# EAGLE design terminator (EAGLE 6.6.0)
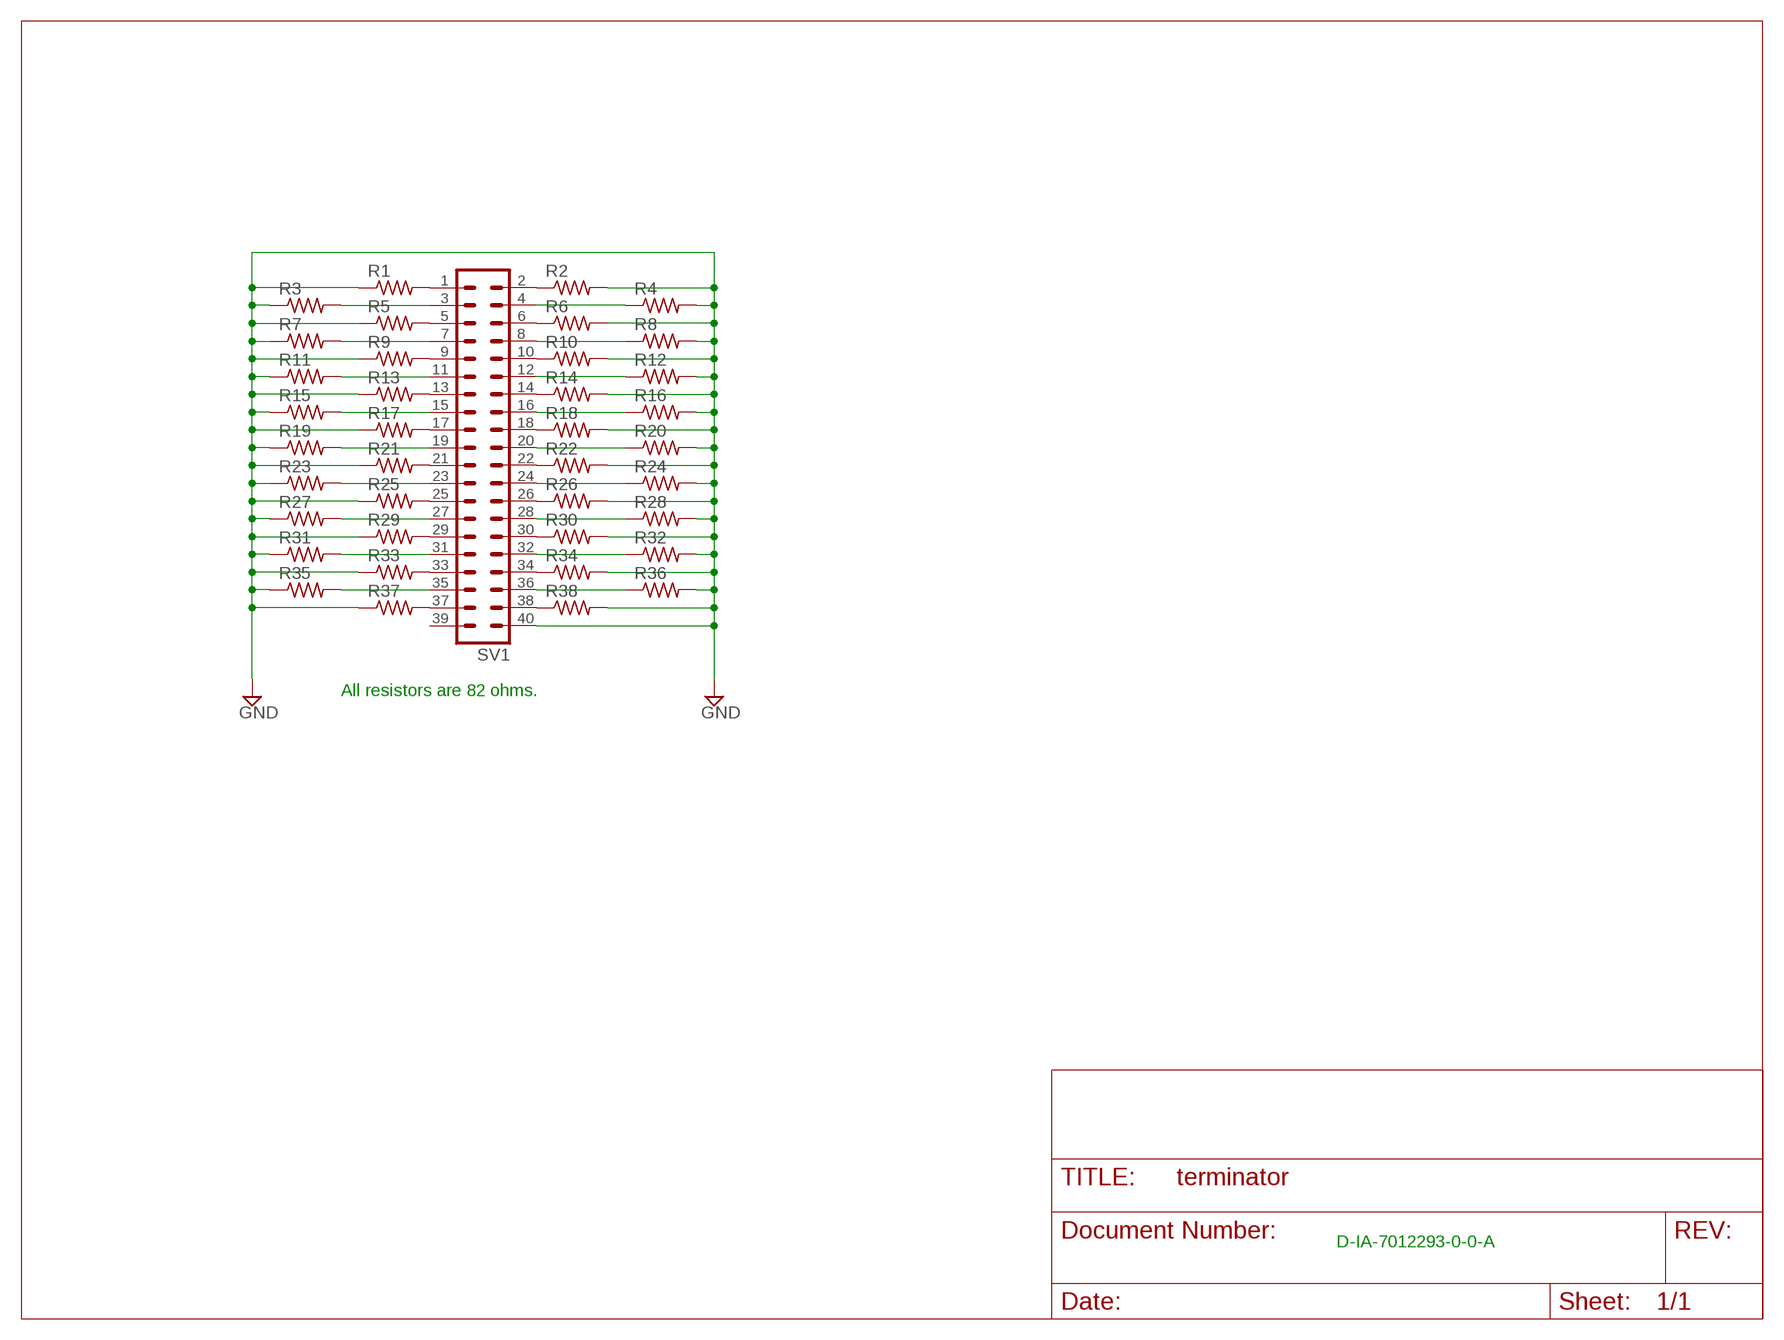
[diagram p0: schematic, sheet 1]

## Parts
R1  R-US_M0805  [M0805]
R2  R-US_M0805  [M0805]
R3  R-US_M0805  [M0805]
R4  R-US_M0805  [M0805]
R5  R-US_M0805  [M0805]
R6  R-US_M0805  [M0805]
R7  R-US_M0805  [M0805]
R8  R-US_M0805  [M0805]
R9  R-US_M0805  [M0805]
R10  R-US_M0805  [M0805]
R11  R-US_M0805  [M0805]
R12  R-US_M0805  [M0805]
R13  R-US_M0805  [M0805]
R14  R-US_M0805  [M0805]
R15  R-US_M0805  [M0805]
R16  R-US_M0805  [M0805]
R17  R-US_M0805  [M0805]
R18  R-US_M0805  [M0805]
R19  R-US_M0805  [M0805]
R20  R-US_M0805  [M0805]
R21  R-US_M0805  [M0805]
R22  R-US_M0805  [M0805]
R23  R-US_M0805  [M0805]
R24  R-US_M0805  [M0805]
R25  R-US_M0805  [M0805]
R26  R-US_M0805  [M0805]
R27  R-US_M0805  [M0805]
R28  R-US_M0805  [M0805]
R29  R-US_M0805  [M0805]
R30  R-US_M0805  [M0805]
R31  R-US_M0805  [M0805]
R32  R-US_M0805  [M0805]
R33  R-US_M0805  [M0805]
R34  R-US_M0805  [M0805]
R35  R-US_M0805  [M0805]
R36  R-US_M0805  [M0805]
R37  R-US_M0805  [M0805]
R38  R-US_M0805  [M0805]
SV1  MA20-2  [MA20-2]

## Nets
GND: R1.1 R2.2 R3.1 R4.2 R5.1 R6.2 R7.1 R8.2 R9.1 R10.2 R11.1 R12.2 R13.1 R14.2 R15.1 R16.2 R17.1 R18.2 R19.1 R20.2 R21.1 R22.2 R23.1 R24.2 R25.1 R26.2 R27.1 R28.2 R29.1 R30.2 R31.1 R32.2 R33.1 R34.2 R35.1 R36.2 R37.1 R38.2 SV1.40
N$1: R1.2 SV1.1
N$2: R2.1 SV1.2
N$3: R5.2 SV1.5
N$4: R6.1 SV1.6
N$5: R9.2 SV1.9
N$6: R10.1 SV1.10
N$7: R13.2 SV1.13
N$8: R14.1 SV1.14
N$9: R17.2 SV1.17
N$10: R18.1 SV1.18
N$11: R21.2 SV1.21
N$12: R22.1 SV1.22
N$13: R25.2 SV1.25
N$14: R26.1 SV1.26
N$15: R29.2 SV1.29
N$16: R30.1 SV1.30
N$17: R33.2 SV1.33
N$18: R34.1 SV1.34
N$19: R37.2 SV1.37
N$20: R38.1 SV1.38
N$21: R3.2 SV1.3
N$22: R7.2 SV1.7
N$23: R11.2 SV1.11
N$24: R15.2 SV1.15
N$25: R19.2 SV1.19
N$26: R23.2 SV1.23
N$27: R27.2 SV1.27
N$28: R31.2 SV1.31
N$29: R35.2 SV1.35
N$30: R36.1 SV1.36
N$31: R32.1 SV1.32
N$32: R28.1 SV1.28
N$33: R24.1 SV1.24
N$34: R20.1 SV1.20
N$35: R16.1 SV1.16
N$36: R12.1 SV1.12
N$37: R8.1 SV1.8
N$38: R4.1 SV1.4
Unconnected: SV1.39

## Notes on the sheet
- All resistors are 82 ohms.
- D-IA-7012293-0-0-A

## Library data of the parts
R1-R38 = rcl:R-US_: RESISTOR, American symbol
SV1 = con-lstb:MA20-2: PIN HEADER; OC_FARNELL: unknown; OC_NEWARK: unknown

## Net classes
0 default: width 0.508 mm

## Board
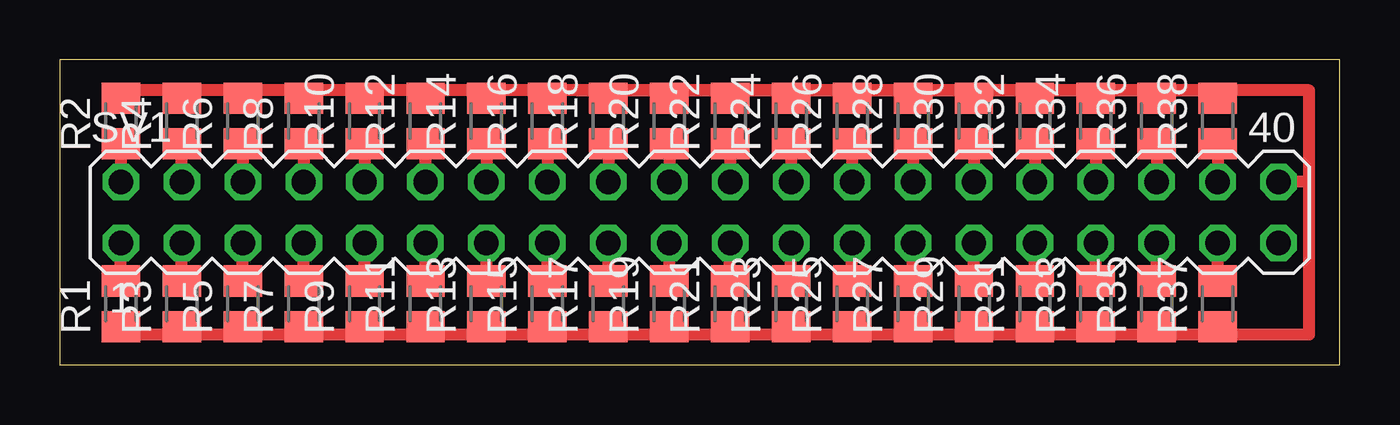
[diagram p1: board, top side]

Size 53.34 x 12.7 mm. Coordinates in mm from the lower left corner, seen from the top.
Outline: 0,0 53.34,0 53.34,12.7 0,12.7 0,0
Copper layers (1+16): Top 0.035mm / dielectric 1.5mm / Bottom 0.035mm
Design rules "16mils *": minimum track width 16mil, minimum drill 32mil, track to track 15mil, track to pad 10mil, pad to pad 10mil, via to via 10mil, smd to smd 0mil, copper to edge 13mil, drill to drill 10mil, minimum pad ring 10mil, minimum via ring 8mil, stop-mask expansion 0mil, vias tented up to drill 0mil, thermal gap 10mil

### Footprints (pad centres in the part's own frame; a part is rotated, then mirrored left to right if it is on the bottom)
M0805 = smd 1.3 x 1.6: 1 -0.95,0; 2 0.95,0
MA20-2 = drill 1.016 octagon: 1 -24.13,-1.27; 2 -24.13,1.27; 3 -21.59,-1.27; 4 -21.59,1.27; 5 -19.05,-1.27; 6 -19.05,1.27; 7 -16.51,-1.27; 8 -16.51,1.27; 9 -13.97,-1.27; 10 -13.97,1.27; 11 -11.43,-1.27; 12 -11.43,1.27; 13 -8.89,-1.27; 14 -8.89,1.27; 15 -6.35,-1.27; 16 -6.35,1.27; 17 -3.81,-1.27; 18 -3.81,1.27; 19 -1.27,-1.27; 20 -1.27,1.27; 21 1.27,-1.27; 22 1.27,1.27; 23 3.81,-1.27; 24 3.81,1.27; 25 6.35,-1.27; 26 6.35,1.27; 27 8.89,-1.27; 28 8.89,1.27; 29 11.43,-1.27; 30 11.43,1.27; 31 13.97,-1.27; 32 13.97,1.27; 33 16.51,-1.27; 34 16.51,1.27; 35 19.05,-1.27; 36 19.05,1.27; 37 21.59,-1.27; 38 21.59,1.27; 39 24.13,-1.27; 40 24.13,1.27

### Placement (x,y rotation side)
R1  2.54,2.54 90 top
R2  2.54,10.16 90 top
R3  5.08,2.54 90 top
R4  5.08,10.16 90 top
R5  7.62,2.54 90 top
R6  7.62,10.16 90 top
R7  10.16,2.54 90 top
R8  10.16,10.16 90 top
R9  12.7,2.54 90 top
R10  12.7,10.16 90 top
R11  15.24,2.54 90 top
R12  15.24,10.16 90 top
R13  17.78,2.54 90 top
R14  17.78,10.16 90 top
R15  20.32,2.54 90 top
R16  20.32,10.16 90 top
R17  22.86,2.54 90 top
R18  22.86,10.16 90 top
R19  25.4,2.54 90 top
R20  25.4,10.16 90 top
R21  27.94,2.54 90 top
R22  27.94,10.16 90 top
R23  30.48,2.54 90 top
R24  30.48,10.16 90 top
R25  33.02,2.54 90 top
R26  33.02,10.16 90 top
R27  35.56,2.54 90 top
R28  35.56,10.16 90 top
R29  38.1,2.54 90 top
R30  38.1,10.16 90 top
R31  40.64,2.54 90 top
R32  40.64,10.16 90 top
R33  43.18,2.54 90 top
R34  43.18,10.16 90 top
R35  45.72,2.54 90 top
R36  45.72,10.16 90 top
R37  48.26,2.54 90 top
R38  48.26,10.16 90 top
SV1  26.67,6.35 0 top

### Tracks (layer width: path | path; a pad name or v marks a point on that pad's centre or on a via)
GND
  Top 0.508: R1.1 3.17,1.27 4.45,1.27 R3.1 5.71,1.27 6.99,1.27 R5.1 8.26,1.27 9.53,1.27 R7.1 10.79,1.27 12.06,1.27 R9.1 13.34,1.27 14.61,1.27 R11.1 15.88,1.27 17.14,1.27 R13.1 18.41,1.27 19.68,1.27 R15.1 20.95,1.27 21.59,1.27 | 21.59,1.27 22.23,1.27 R17.1 23.5,1.27 24.77,1.27 R19.1 26.04,1.27 27.3,1.27 R21.1 28.57,1.27 29.84,1.27 R23.1 31.11,1.27 32.38,1.27 R25.1 33.66,1.27 34.92,1.27 R27.1 36.2,1.27 37.47,1.27 R29.1 38.73,1.27 40.01,1.27 R31.1 41.27,1.27 42.55,1.27 R33.1 43.81,1.27 45.09,1.27 R35.1 46.35,1.27 47.62,1.27 R37.1 | R2.2 3.17,11.43 4.45,11.43 R4.2 5.71,11.43 6.99,11.43 R6.2 8.26,11.43 9.53,11.43 R8.2 10.79,11.43 12.06,11.43 R10.2 13.34,11.43 14.61,11.43 R12.2 15.88,11.43 17.14,11.43 R14.2 18.41,11.43 19.68,11.43 R16.2 20.95,11.43 21.59,11.43 | 21.59,11.43 22.23,11.43 R18.2 23.5,11.43 24.77,11.43 R20.2 26.04,11.43 27.3,11.43 R22.2 28.57,11.43 29.84,11.43 R24.2 31.11,11.43 32.38,11.43 R26.2 33.66,11.43 34.92,11.43 R28.2 36.2,11.43 37.47,11.43 R30.2 38.73,11.43 40.01,11.43 R32.2 41.27,11.43 42.55,11.43 R34.2 43.81,11.43 45.09,11.43 R36.2 46.35,11.43 47.62,11.43 R38.2 | 21.59,1.27 52.07,1.27 52.07,7.62 | 52.07,7.62 52.07,11.43 21.59,11.43 | 52.07,7.62 51.44,7.62 SV1.40
N$1
  Top 0.508: R1.2 2.54,3.81 2.54,4.45 SV1.1
N$2
  Top 0.508: R2.1 2.54,8.89 2.54,8.26 SV1.2
N$3
  Top 0.508: R5.2 7.62,3.81 7.62,4.45 SV1.5
N$4
  Top 0.508: R6.1 7.62,8.89 7.62,8.26 SV1.6
N$5
  Top 0.508: R9.2 12.7,3.81 12.7,4.45 SV1.9
N$6
  Top 0.508: R10.1 12.7,8.89 12.7,8.26 SV1.10
N$7
  Top 0.508: R13.2 17.78,3.81 17.78,4.45 SV1.13
N$8
  Top 0.508: R14.1 17.78,8.89 17.78,8.26 SV1.14
N$9
  Top 0.508: R17.2 22.86,3.81 22.86,4.45 SV1.17
N$10
  Top 0.508: R18.1 22.86,8.89 22.86,8.26 SV1.18
N$11
  Top 0.508: R21.2 27.94,3.81 27.94,4.45 SV1.21
N$12
  Top 0.508: R22.1 27.94,8.89 27.94,8.26 SV1.22
N$13
  Top 0.508: R25.2 33.02,3.81 33.02,4.45 SV1.25
N$14
  Top 0.508: R26.1 33.02,8.89 33.02,8.26 SV1.26
N$15
  Top 0.508: R29.2 38.1,3.81 38.1,4.45 SV1.29
N$16
  Top 0.508: R30.1 38.1,8.89 38.1,8.26 SV1.30
N$17
  Top 0.508: R33.2 43.18,3.81 43.18,4.45 SV1.33
N$18
  Top 0.508: R34.1 43.18,8.89 43.18,8.26 SV1.34
N$19
  Top 0.508: R37.2 48.26,3.81 48.26,4.45 SV1.37
N$20
  Top 0.508: R38.1 48.26,8.89 48.26,8.26 SV1.38
N$21
  Top 0.508: R3.2 5.08,3.81 5.08,4.45 SV1.3
N$22
  Top 0.508: R7.2 10.16,3.81 10.16,4.45 SV1.7
N$23
  Top 0.508: R11.2 15.24,3.81 15.24,4.45 SV1.11
N$24
  Top 0.508: R15.2 20.32,3.81 20.32,4.45 SV1.15
N$25
  Top 0.508: R19.2 25.4,3.81 25.4,4.45 SV1.19
N$26
  Top 0.508: R23.2 30.48,3.81 30.48,4.45 SV1.23
N$27
  Top 0.508: R27.2 35.56,3.81 35.56,4.45 SV1.27
N$28
  Top 0.508: R31.2 40.64,3.81 40.64,4.45 SV1.31
N$29
  Top 0.508: R35.2 45.72,3.81 45.72,4.45 SV1.35
N$30
  Top 0.508: R36.1 45.72,8.89 45.72,8.26 SV1.36
N$31
  Top 0.508: R32.1 40.64,8.89 40.64,8.26 SV1.32
N$32
  Top 0.508: R28.1 35.56,8.89 35.56,8.26 SV1.28
N$33
  Top 0.508: R24.1 30.48,8.89 30.48,8.26 SV1.24
N$34
  Top 0.508: R20.1 25.4,8.89 25.4,8.26 SV1.20
N$35
  Top 0.508: R16.1 20.32,8.89 20.32,8.26 SV1.16
N$36
  Top 0.508: R12.1 15.24,8.89 15.24,8.26 SV1.12
N$37
  Top 0.508: R8.1 10.16,8.89 10.16,8.26 SV1.8
N$38
  Top 0.508: R4.1 5.08,8.89 5.08,8.26 SV1.4